# Altium schematic sheet [01] - COVER PAGE.SchDoc: Cover Page
size A3; Date: 23/3/2025; DrawnBy: Le Viet Trong; Revision: V1.1; SheetNumber: 1; SheetTotal: 7
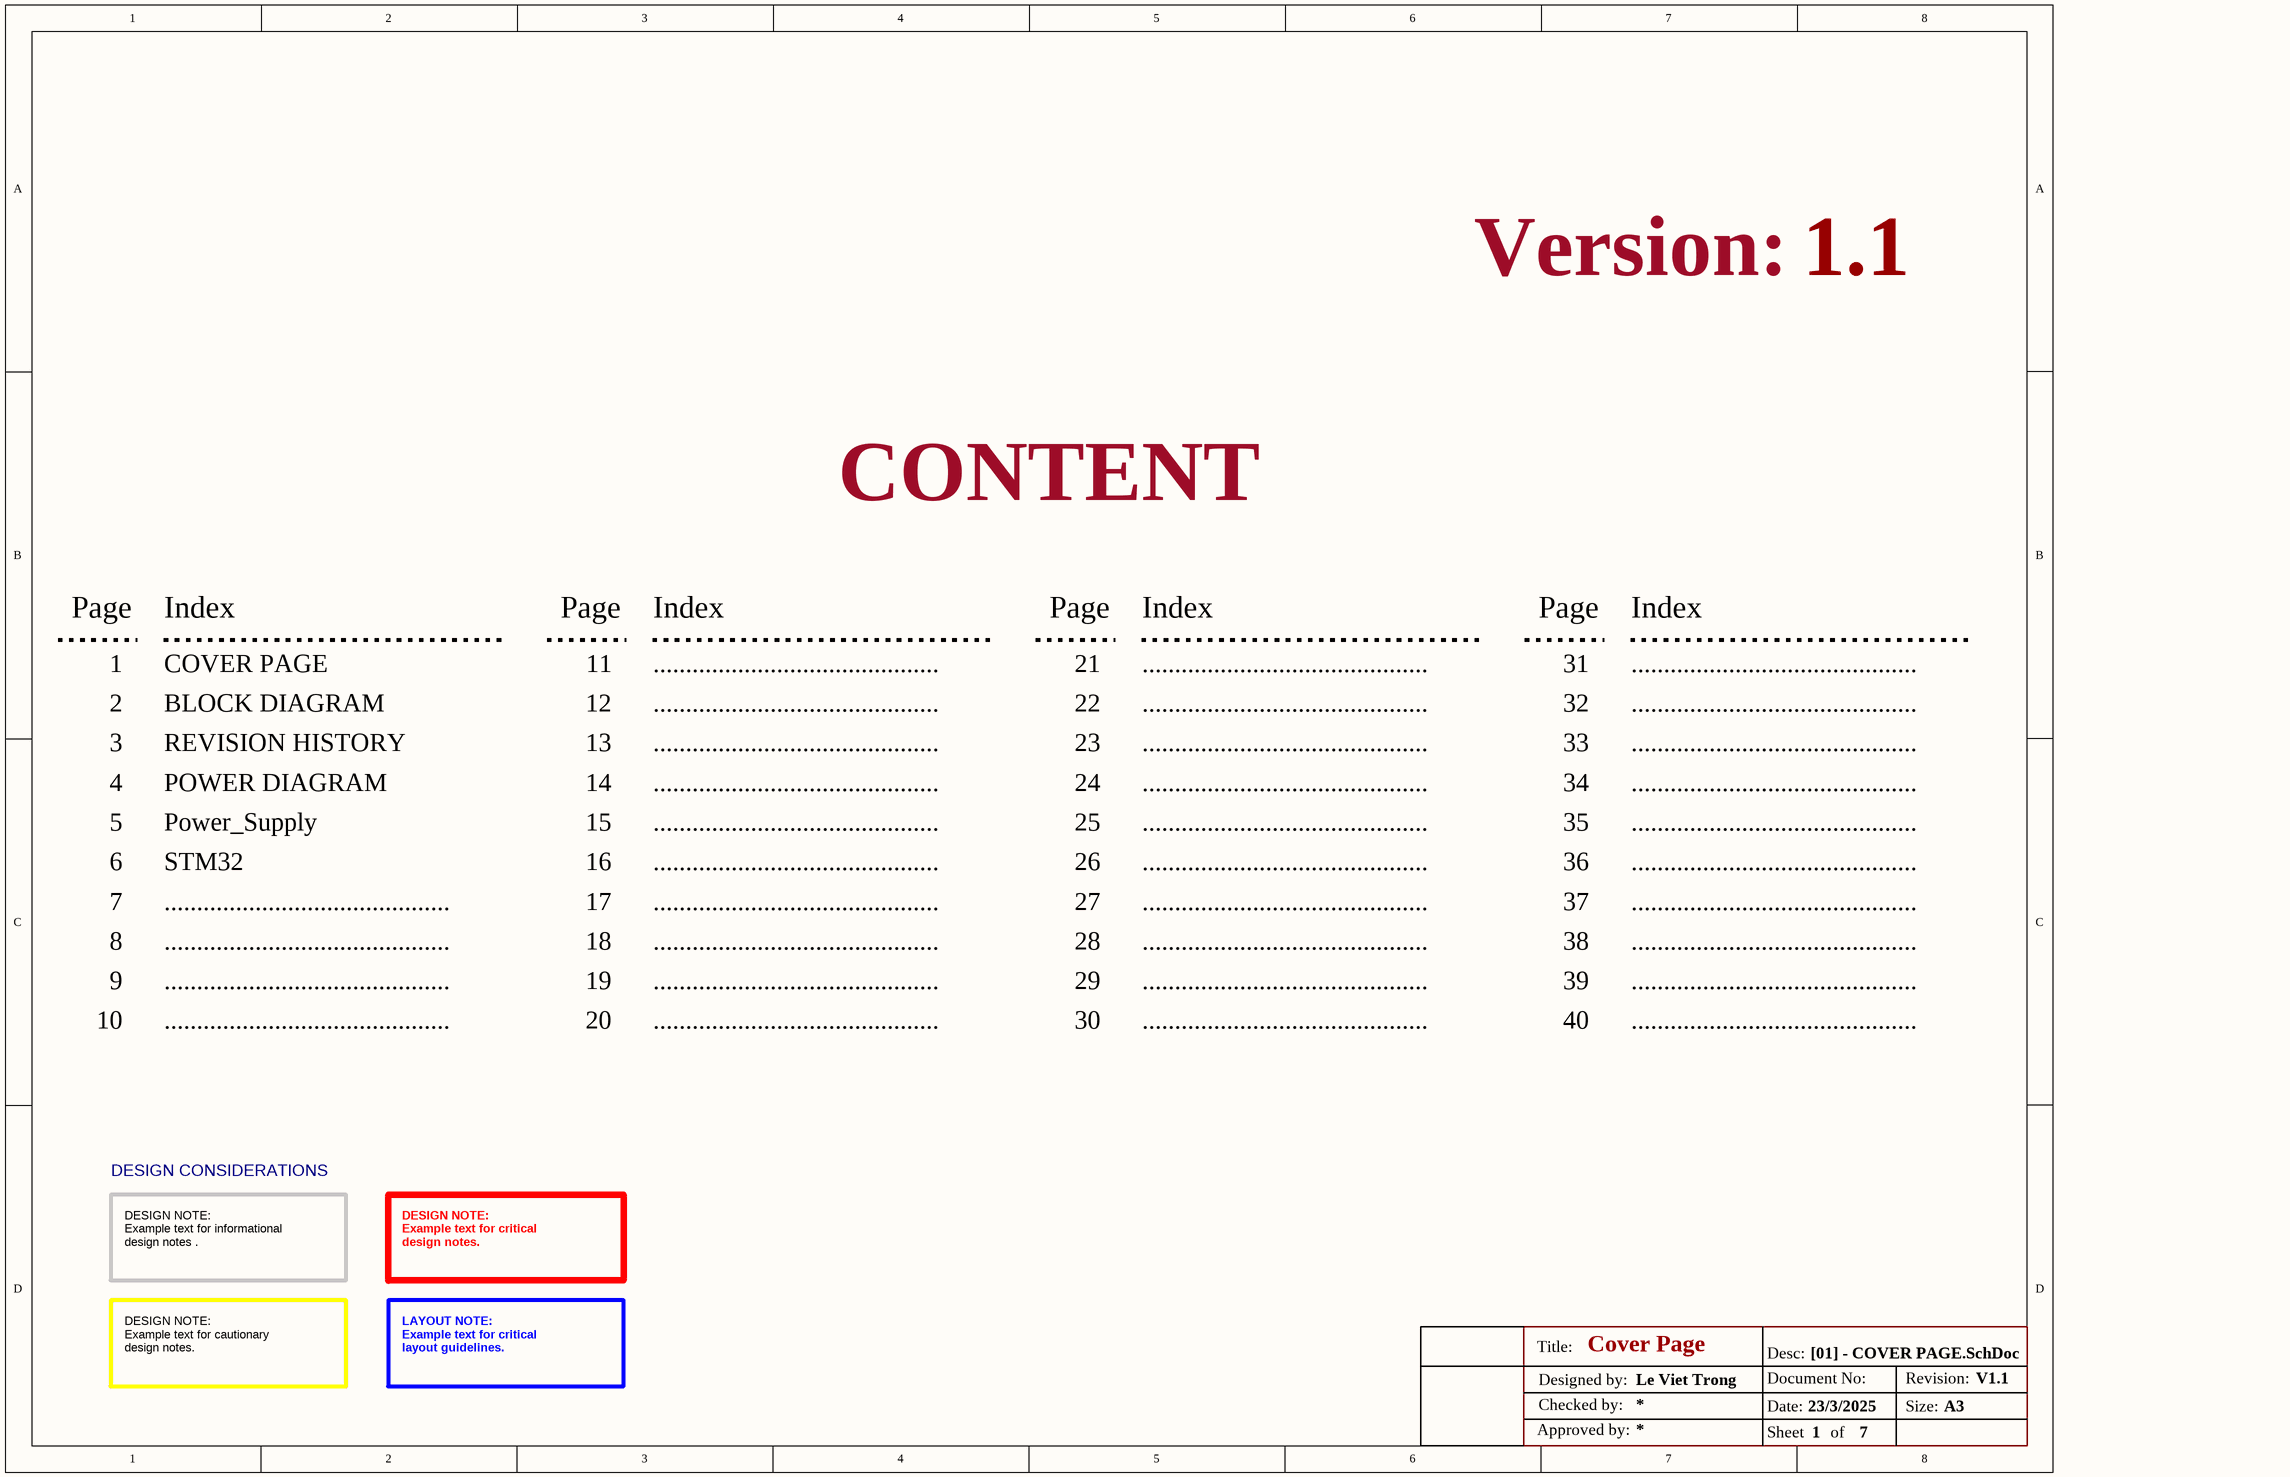
[diagram p0: [01] - COVER PAGE.SchDoc]

## Notes on the sheet
- Version:
- 1.1
- CONTENT
- Page
- Index
- 1
- COVER PAGE
- 11
- ............................................
- 21
- 31
- 2
- 3
- BLOCK DIAGRAM
- REVISION HISTORY
- 12
- 13
- 22
- 23
- 32
- 33
- 4
- 5
- POWER DIAGRAM
- Power_Supply
- 14
- 15
- 24
- 25
- 34
- 35
- 6
- STM32
- 16
- 26
- 36
- 7
- 8
- 17
- 18
- 27
- 28
- 37
- 38
- 9
- 10
- 19
- 20
- 29
- 30
- 39
- 40
- DESIGN CONSIDERATIONS
- DESIGN NOTE:
  Example text for informational
  design notes .
- DESIGN NOTE:
  Example text for critical
  design notes.
- DESIGN NOTE:
  Example text for cautionary
  design notes.
- LAYOUT NOTE:
  Example text for critical
  layout guidelines.
- Title:
- Desc:
- Designed by:
- Checked by:
- Date:
- Document No:
- Revision:
- Size:
- A3
- Approved by:
- Sheet
- of